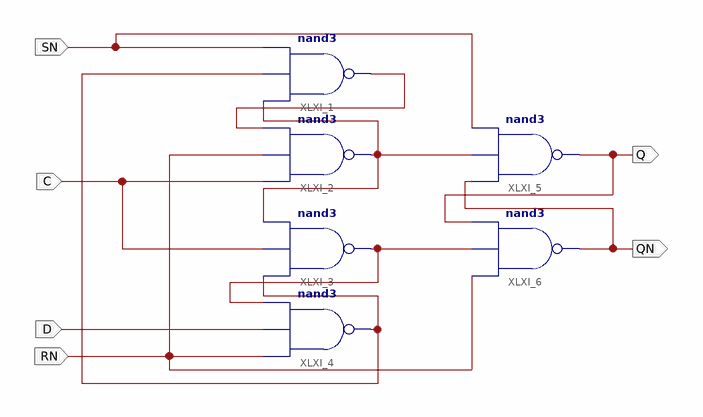
[diagram p0: schematic sheet 1]
// Xilinx ISE schematic D_FLIPFLOP.sch (kintex7) as structural Verilog: 6 symbols, 6 ports
module D_FLIPFLOP (
  input  C,
  input  SN,
  input  RN,
  input  D,
  output QN,
  output Q
);

  wire XLXN_12, XLXN_13, XLXN_16, XLXN_17;

  nand XLXI_1 (XLXN_17, XLXN_16, XLXN_12, SN);
  nand XLXI_2 (XLXN_16, C, RN, XLXN_17);
  nand XLXI_3 (XLXN_13, XLXN_12, C, XLXN_16);
  nand XLXI_4 (XLXN_12, RN, D, XLXN_13);
  nand XLXI_5 (Q, QN, XLXN_16, SN);
  nand XLXI_6 (QN, RN, XLXN_13, Q);
endmodule
